# EAGLE design board (EAGLE 9.6.2)
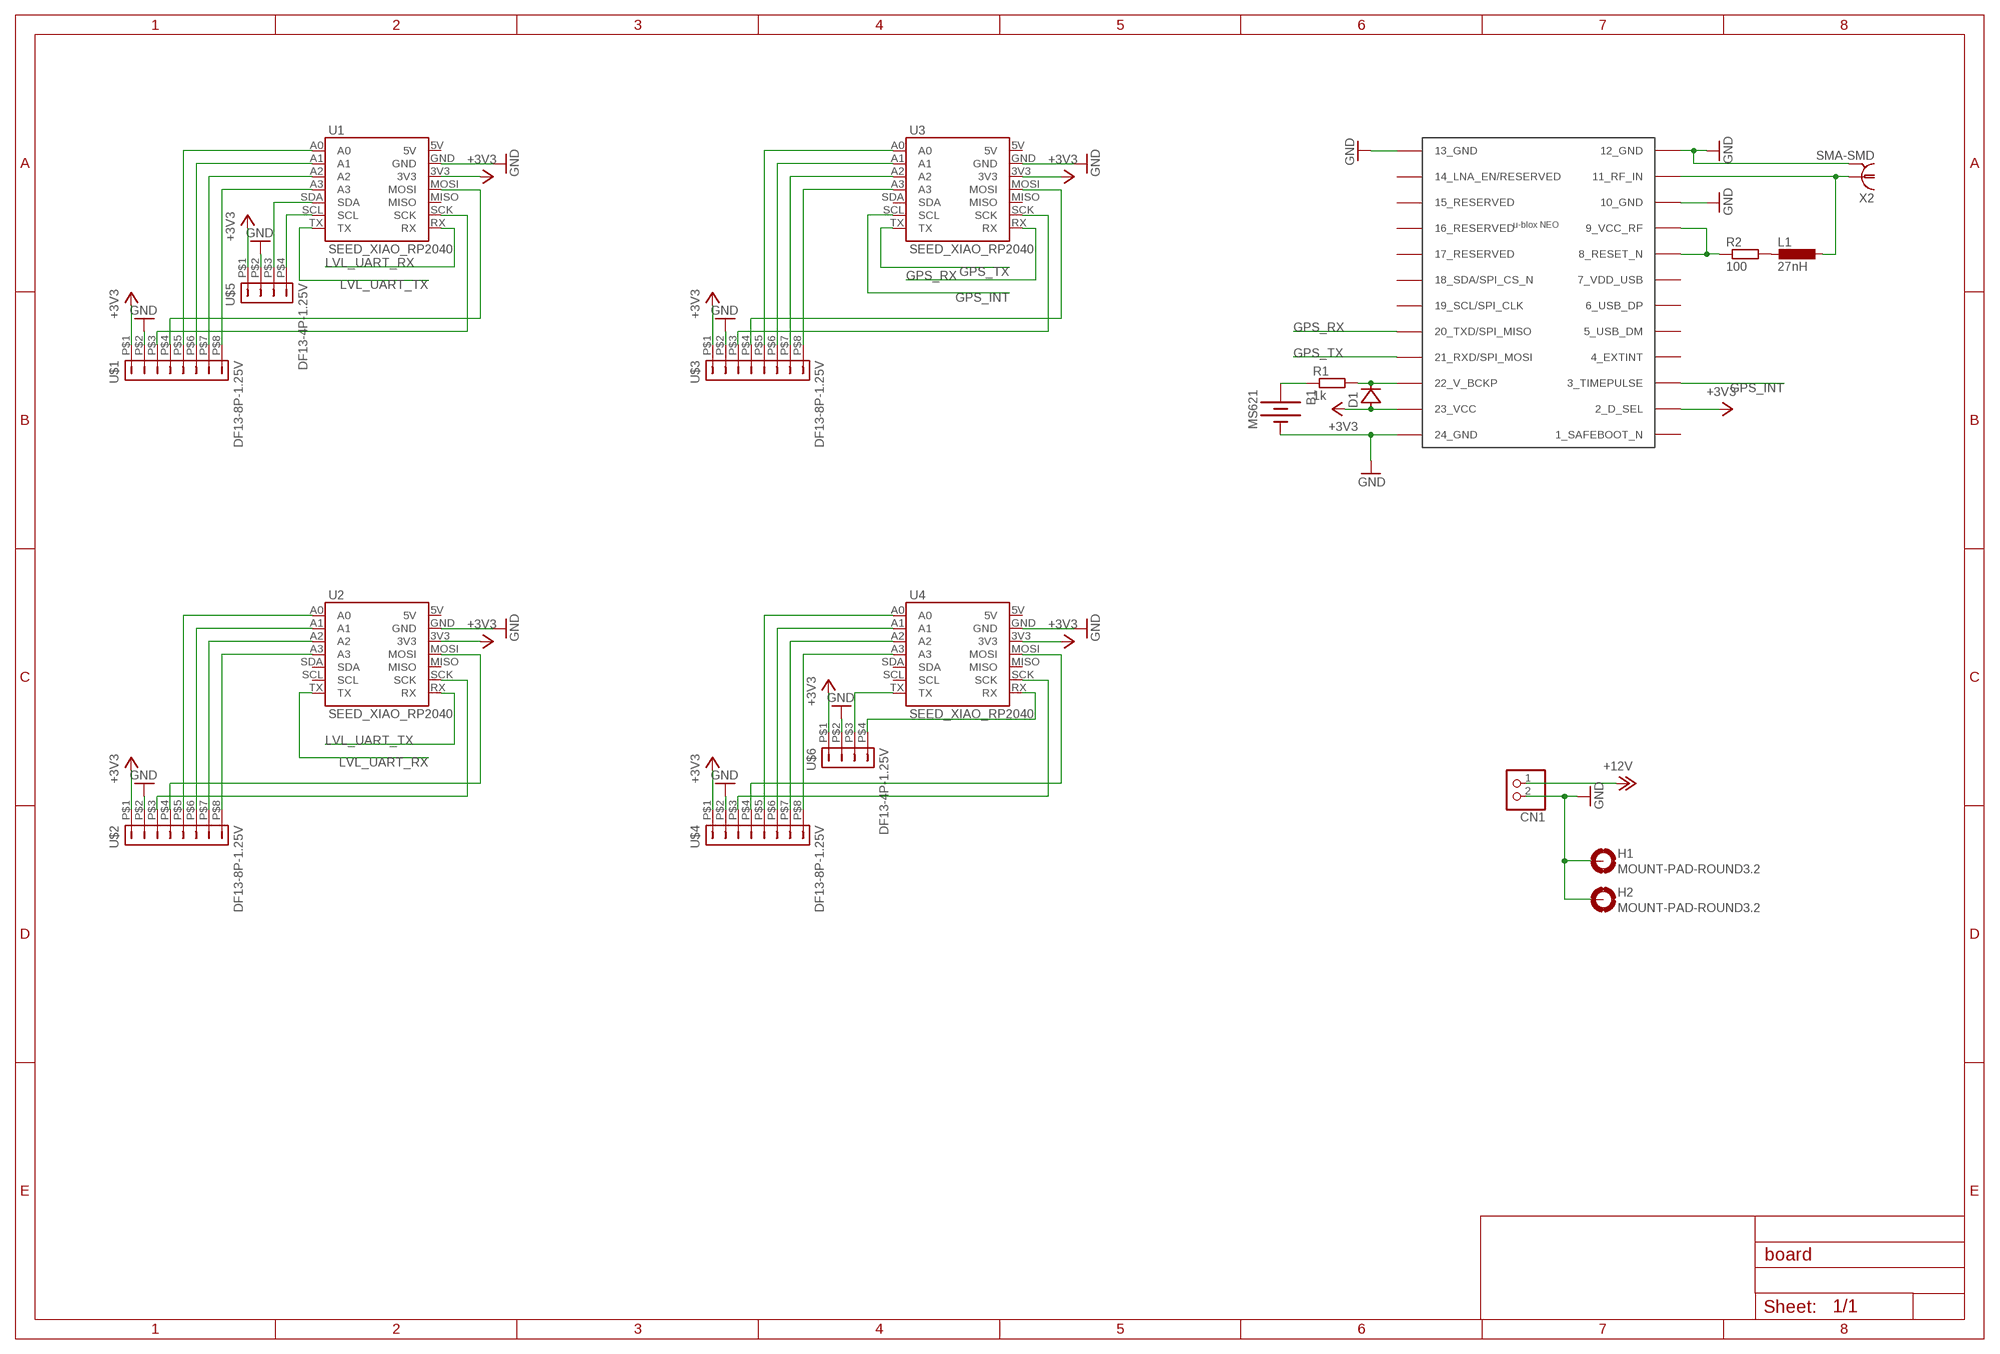
[diagram p0: schematic, sheet 1]

## Parts
B1  MS621  [MS621FE-IL36E]
CN1  JST_2PIN-SMT-RA  [JST-PH-2-SMT-RA]
D1  DIODESOD-123  [SOD123]
H1  MOUNT-PAD-ROUND3.2  [3,2-PAD]
H2  MOUNT-PAD-ROUND3.2  [3,2-PAD]
L1  27nH  INDUCTOR0805  [L2012C]
R1  1k  RESISTOR0805  [R0805]
R2  100  RESISTOR0805  [R0805]
U1  SEED_XIAO_RP2040  [SEED_XIAO_RP2040]
U2  SEED_XIAO_RP2040  [SEED_XIAO_RP2040]
U3  SEED_XIAO_RP2040  [SEED_XIAO_RP2040]
U4  SEED_XIAO_RP2040  [SEED_XIAO_RP2040]
U$1  DF13-8P-1.25V  [DF13C-8P-1.25V]
U$2  DF13-8P-1.25V  [DF13C-8P-1.25V]
U$3  DF13-8P-1.25V  [DF13C-8P-1.25V]
U$4  DF13-8P-1.25V  [DF13C-8P-1.25V]
U$5  DF13-4P-1.25V  [DF13C-4P-1.25V]
U$6  DF13-4P-1.25V  [DF13C-4P-1.25V]
U$7  NEO-M8  [NEO-M8]
X2  SMA-SMD  [SMA-SMD]

## Nets
+3V3: D1.A U1.3V3 U2.3V3 U3.3V3 U4.3V3 U$1.P$1 U$2.P$1 U$3.P$1 U$4.P$1 U$5.P$1 U$6.P$1 U$7.2(2_D_SEL) U$7.23(23_VCC)
+12V: CN1.1
GND: B1.P$1(-) CN1.2 H1.B3,2(MOUNT) H1.P$1(MOUNT) H1.P$2(MOUNT) H1.P$3(MOUNT) H1.P$4(MOUNT) H1.P$5(MOUNT) H1.P$6(MOUNT) H1.P$7(MOUNT) H1.P$8(MOUNT) H2.B3,2(MOUNT) H2.P$1(MOUNT) H2.P$2(MOUNT) H2.P$3(MOUNT) H2.P$4(MOUNT) H2.P$5(MOUNT) H2.P$6(MOUNT) H2.P$7(MOUNT) H2.P$8(MOUNT) U1.GND U2.GND U3.GND U4.GND U$1.P$2 U$2.P$2 U$3.P$2 U$4.P$2 U$5.P$2 U$6.P$2 U$7.10(10_GND) U$7.12(12_GND) U$7.13(13_GND) U$7.24(24_GND) X2.2@1 X2.2@2 X2.2@3 X2.2@4 X2.2@5 X2.2@6
GPS_INT: U3.SCL U$7.3(3_TIMEPULSE)
GPS_RX: U3.RX U$7.20(20_TXD/SPI_MISO)
GPS_TX: U3.TX U$7.21(21_RXD/SPI_MOSI)
LVL_UART_RX: U1.RX U2.TX
LVL_UART_TX: U1.TX U2.RX
N$1: U1.A3 U$1.P$8
N$2: U1.A2 U$1.P$7
N$3: U1.SCL U$5.P$4
N$4: U1.SDA U$5.P$3
N$5: U1.A1 U$1.P$6
N$6: U1.A0 U$1.P$5
N$7: U1.SCK U$1.P$3
N$8: U1.MOSI U$1.P$4
N$9: U2.SCK U$2.P$3
N$10: U2.MOSI U$2.P$4
N$11: U2.A3 U$2.P$8
N$12: U2.A2 U$2.P$7
N$13: U2.A1 U$2.P$6
N$14: U2.A0 U$2.P$5
N$15: U3.A3 U$3.P$8
N$16: U3.A2 U$3.P$7
N$17: U3.A1 U$3.P$6
N$18: U3.A0 U$3.P$5
N$19: U3.SCK U$3.P$3
N$20: U3.MOSI U$3.P$4
N$21: U4.A3 U$4.P$8
N$22: U4.A2 U$4.P$7
N$23: U4.A1 U$4.P$6
N$24: U4.A0 U$4.P$5
N$25: U4.SCK U$4.P$3
N$26: U4.MOSI U$4.P$4
N$27: U4.TX U$6.P$3
N$28: U4.RX U$6.P$4
N$29: L1.1 U$7.11(11_RF_IN) X2.1
N$30: B1.P$2(+) R1.1
N$31: D1.C R1.2 U$7.22(22_V_BCKP)
N$32: R2.1 U$7.8(8_RESET_N) U$7.9(9_VCC_RF)
N$33: L1.2 R2.2
Unconnected: U1.5V U1.MISO U2.5V U2.MISO U2.SCL U2.SDA U3.5V U3.MISO U3.SDA U4.5V U4.MISO U4.SCL U4.SDA U$7.1(1_SAFEBOOT_N) U$7.4(4_EXTINT) U$7.5(5_USB_DM) U$7.6(6_USB_DP) U$7.7(7_VDD_USB) U$7.14(14_LNA_EN/RESERVED) U$7.15(15_RESERVED) U$7.16(16_RESERVED) U$7.17(17_RESERVED) U$7.18(18_SDA/SPI_CS_N) U$7.19(19_SCL/SPI_CLK)

## Library data of the parts
B1 = SMD:MS621
CN1 = adafruit:JST_2PIN: JST 2-Pin Connectors of various flavors SMT-RA (S2B-PH-SM4) 4UConnector #17311 SMT (B2B-PH-SM4) THM-RA (S2B-PH) THM (B2B-PH)
D1 = SMD:DIODE
H1 H2 = THT:MOUNT-PAD-ROUND: MOUNTING PAD, round
L1 = SMD:INDUCTOR
R1 R2 = SMD:RESISTOR
U1-U4 = SMD:SEED_XIAO_RP2040
U$1-U$4 = SMD:DF13-8P-1.25: DF13-8P 1.25mm Pitch Miniature Crimping Connector.
U$5 U$6 = SMD:DF13-4P-1.25: DF13-4P 1.25mm Pitch Miniature Crimping Connector.
U$7 = SMD:NEO-M8: u-blox NEO GNSS module
X2 = SMD:SMA-SMD: SMA 50 Ohm Straight Jack Receptacle - Surface Mount www.johnsoncomponents.com Source: http://catalog.digikey.com .. 142-0711-201, 205, 202, 206.pdf; OC_FARNELL: unknown; OC_NEWARK: unknown

## Board
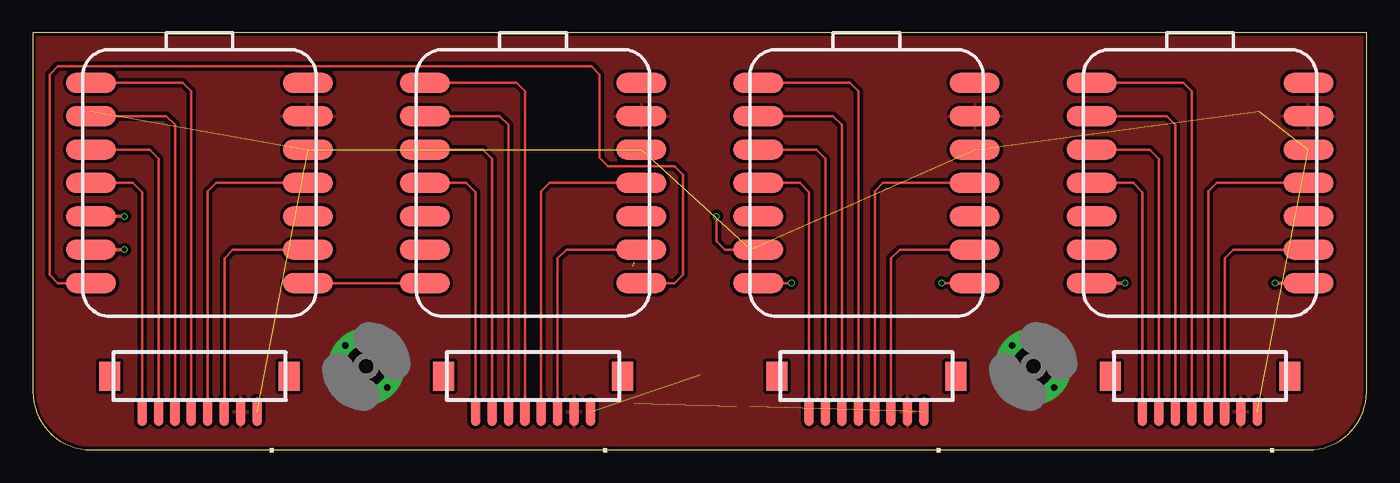
[diagram p1: board, top side]
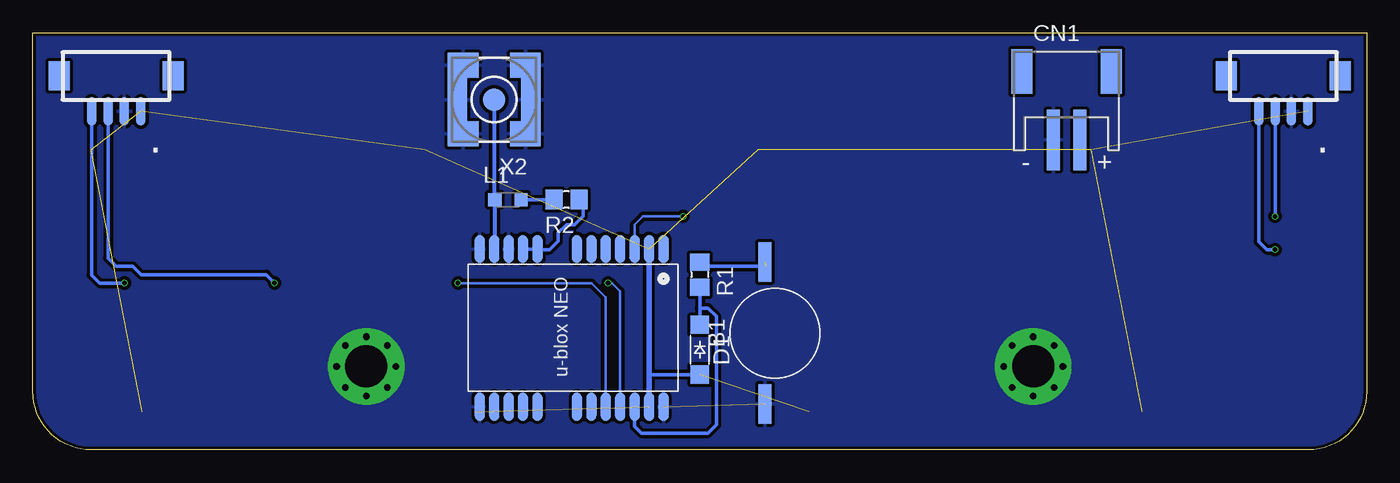
[diagram p2: board, bottom side, seen from below]

Size 101.6 x 31.75 mm. Coordinates in mm from the lower left corner, seen from the top.
Outline: 0,31.75 0,4.45 arc90 4.45,0 97.16,0 arc90 101.6,4.45 101.6,31.75 0,31.75
Copper layers (1*16): Top 0.035mm / dielectric 1.6mm / Bottom 0.035mm
Design rules "jlc-pcb": minimum track width 5mil, minimum drill 0.3mm, track to track 5mil, track to pad 5mil, pad to pad 5mil, via to via 5mil, smd to smd 5mil, copper to edge 0.2mm, drill to drill 6mil, minimum pad ring 10mil, minimum via ring 3mil, stop-mask expansion 4mil, vias tented up to drill 0mil, thermal gap 10mil

### Footprints (pad centres in the part's own frame; a part is rotated, then mirrored left to right if it is on the bottom)
MS621FE-IL36E = smd 3 x 1: P$1 -5.4,0.75; P$2 5.4,0.75
JST-PH-2-SMT-RA = smd 1 x 4.6: 1 1,-3.7; 2 -1,-3.7 | smd 1.6 x 3.4: NC1 -3.4,1.5; NC2 3.4,1.5
SOD123 = smd 1.4 x 1.4: A 1.9,0; C -1.9,0
3,2-PAD = drill 3.2 pad 5.842: B3,2 0,0 | drill 0.5: P$1 0,2.261; P$2 0,-2.261; P$3 2.261,0; P$4 -2.261,0; P$5 -1.598,1.598; P$6 1.598,1.598; P$7 -1.598,-1.598; P$8 1.598,-1.598
L2012C = smd 1 x 1: 1 -1,0; 2 1,0
R0805 = smd 1.3 x 1.5: 1 -0.95,0; 2 0.95,0
SEED_XIAO_RP2040 = smd 3.81 x 1.524: 3V3 8.255,2.54; 5V 8.255,7.62; A0 -8.255,7.62; A1 -8.255,5.08; A2 -8.255,2.54; A3 -8.255,0; GND 8.255,5.08; MISO 8.255,-2.54; MOSI 8.255,0; RX 8.255,-7.62; SCK 8.255,-5.08; SCL -8.255,-5.08; SDA -8.255,-2.54; TX -8.255,-7.62
DF13C-8P-1.25V = smd 1.6 x 2.2: M$0 6.825,-1.8; M$1 -6.825,-1.8 | smd 0.711 x 2.159: P$1 -4.375,0.9; P$2 -3.125,0.9; P$3 -1.875,0.9; P$4 -0.625,0.9; P$5 0.625,0.9; P$6 1.875,0.9; P$7 3.125,0.9; P$8 4.375,0.9
DF13C-4P-1.25V = smd 1.6 x 2.2: M$0 4.325,-1.8; M$1 -4.325,-1.8 | smd 0.711 x 2.159: P$1 -1.875,0.9; P$2 -0.625,0.9; P$3 0.625,0.9; P$4 1.875,0.9
NEO-M8 = smd 2.159 x 0.762: 1 6.4,-7.4; 2 6.4,-6.3; 3 6.4,-5.2; 4 6.4,-4.1; 5 6.4,-3; 6 6.4,-1.9; 7 6.4,-0.8; 8 6.4,2.2; 9 6.4,3.3; 10 6.4,4.4; 11 6.4,5.5; 12 6.4,6.6; 13 -5.6,6.6; 14 -5.6,5.5; 15 -5.6,4.4; 16 -5.6,3.3; 17 -5.6,2.2; 18 -5.6,-0.8; 19 -5.6,-1.9; 20 -5.6,-3; 21 -5.6,-4.1; 22 -5.6,-5.2; 23 -5.6,-6.3; 24 -5.6,-7.4
SMA-SMD = smd 1.73 x 1.73: 1 0,0 | smd 2.35 x 1.9: 2@1 -2.375,2.6; 2@2 -2.375,-2.6; 2@3 2.375,-2.6; 2@4 2.375,2.6 | smd 1.5 x 3.4: 2@5 -2.8,0; 2@6 2.8,0

### Placement (x,y rotation side)
B1  45.09,8.89 90 bottom
CN1  22.86,27.3 0 bottom
D1  50.8,7.62 270 bottom
H1  25.4,6.35 0 top
H2  76.2,6.35 0 top
L1  65.41,19.05 0 bottom
R1  50.8,13.34 270 bottom
R2  60.96,19.05 180 bottom
U1  12.7,20.32 0 top
U2  38.1,20.32 0 top
U3  63.5,20.32 0 top
U4  88.9,20.32 0 top
U$1  12.7,3.81 180 top
U$2  38.1,3.81 180 top
U$3  63.5,3.81 180 top
U$4  88.9,3.81 180 top
U$5  6.35,26.67 180 bottom
U$6  95.25,26.67 180 bottom
U$7  60.96,8.89 90 bottom
X2  66.46,26.67 180 bottom

### Tracks (layer width: path | path; a pad name or v marks a point on that pad's centre or on a via)
+3V3  (10 unrouted)
  Bottom 0.254: D1.A 54.66,5.72 54.66,5.71
  Bottom 0.406: U$7.23 54.66,5.71 U$7.2
GND  (1 unrouted)
  pour Bottom (isolate 0.254): 0,31.75 0,4.45 arc90 4.45,0 101.6,0 101.6,31.75
  pour Top (isolate 0.254): 0,31.75 101.6,31.75 101.6,0 4.45,0 arc-90 0,4.45
GPS_INT  (via drill 0.35)
  Top 0.203: U3.SCL 52.7,15.24 52.07,15.88 v52.07,17.78
  Bottom 0.203: U$7.3 55.76,17.14 55.12,17.78 v52.07,17.78
GPS_RX  (via drill 0.35)
  Top 0.203: v69.22,12.7 U3.RX
  Bottom 0.203: U$7.20 57.96,11.61 59.05,12.7 v69.22,12.7
GPS_TX  (via drill 0.35)
  Top 0.203: v57.78,12.7 U3.TX
  Bottom 0.203: U$7.21 56.86,12.06 57.48,12.7 v57.78,12.7
LVL_UART_RX
  Top 0.203: U2.TX U1.RX
LVL_UART_TX
  Top 0.203: U1.TX 1.91,12.7 1.27,13.34 1.27,28.57 1.91,29.21 42.55,29.21 43.18,28.57 43.18,22.23 43.81,21.59 48.9,21.59 49.53,20.95 49.53,13.34 48.9,12.7 U2.RX
N$1
  Top 0.203: U$1.P$8 8.32,19.61 7.62,20.32 U1.A3
N$2
  Top 0.203: U$1.P$7 9.57,22.18 8.89,22.86 U1.A2
N$3  (via drill 0.35)
  Top 0.254: v6.99,15.24 U1.SCL
  Bottom 0.254: U$5.P$4 8.22,15.85 7.62,15.24 v6.99,15.24
N$4  (via drill 0.35)
  Top 0.254: v6.99,17.78 U1.SDA
  Bottom 0.254: U$5.P$3 6.97,17.79 v6.99,17.78
N$5
  Top 0.203: U$1.P$6 10.82,24.73 10.16,25.4 6.35,25.4 U1.A1
N$6
  Top 0.203: U$1.P$5 12.07,27.3 11.43,27.94 U1.A0
N$7
  Top 0.203: 14.6,14.6 14.61,14.61 | 14.61,14.61 15.24,15.24 U1.SCK | 14.61,14.61 14.61,2.94 U$1.P$3
N$8
  Top 0.203: U1.MOSI 13.97,20.32 13.32,19.68 U$1.P$4
N$9
  Top 0.203: U2.SCK 40.64,15.24 39.98,14.57 U$2.P$3
N$10
  Top 0.203: U2.MOSI 39.37,20.32 38.73,19.68 U$2.P$4
N$11
  Top 0.203: U$2.P$8 33.73,19.61 33.02,20.32 U2.A3
N$12
  Top 0.203: U$2.P$7 34.98,22.18 34.29,22.86 U2.A2
N$13
  Top 0.203: U$2.P$6 36.23,24.73 35.56,25.4 U2.A1
N$14
  Top 0.203: U$2.P$5 37.48,27.3 36.83,27.94 U2.A0 29.21,27.94
N$15
  Top 0.203: U$3.P$8 59.12,19.61 58.42,20.32 U3.A3
N$16
  Top 0.203: U$3.P$7 60.38,22.18 59.69,22.86 U3.A2
N$17
  Top 0.203: U$3.P$6 61.62,24.73 60.96,25.4 U3.A1
N$18
  Top 0.203: U$3.P$5 62.88,27.3 62.23,27.94 U3.A0
N$19
  Top 0.203: U3.SCK 66.04,15.24 65.38,14.57 U$3.P$3
N$20
  Top 0.203: U3.MOSI 64.77,20.32 64.12,19.68 U$3.P$4
N$21
  Top 0.203: U$4.P$8 84.53,19.61 83.82,20.32 U4.A3
N$22
  Top 0.203: U$4.P$7 85.78,22.18 85.09,22.86 U4.A2
N$23
  Top 0.203: U$4.P$6 87.03,24.73 86.36,25.4 U4.A1
N$24
  Top 0.203: U$4.P$5 88.28,27.3 87.63,27.94 U4.A0
N$25
  Top 0.203: 90.8,14.6 90.81,14.61 | 90.81,14.61 91.44,15.24 U4.SCK | 90.81,14.61 90.81,2.94 U$4.P$3
N$26
  Top 0.203: U4.MOSI 90.17,20.32 89.53,19.68 U$4.P$4
N$27  (via drill 0.35)
  Top 0.254: v83.19,12.7 U4.TX
  Bottom 0.254: v83.19,12.7 83.82,13.34 93.34,13.34 93.98,13.97 95.25,13.97 95.88,14.6 U$6.P$3
N$28  (via drill 0.35)
  Top 0.254: v94.61,12.7 U4.RX
  Bottom 0.254: U$6.P$4 97.12,13.3 96.52,12.7 v94.61,12.7
N$29
  Bottom 0.305: X2.1 66.46,19.11 L1.1 66.41,15.35 U$7.11
N$30  (1 unrouted)
  Bottom 0.254: R1.1 50.48,13.97 45.72,13.97
N$31
  Bottom 0.254: U$7.22 55.76,1.78 55.24,1.27 50.16,1.27 49.53,1.91 49.53,10.16 50.16,10.79 50.8,10.79 | R1.2 50.8,10.79 | 50.8,10.79 D1.C
N$32
  Bottom 0.254: U$7.9 U$7.8 63.11,15.24 62.23,15.24 61.59,15.88 61.59,16.51 60.96,17.14 60.33,17.14 59.69,17.78 59.69,18.73 R2.1
N$33
  Bottom 0.254: L1.2 R2.2